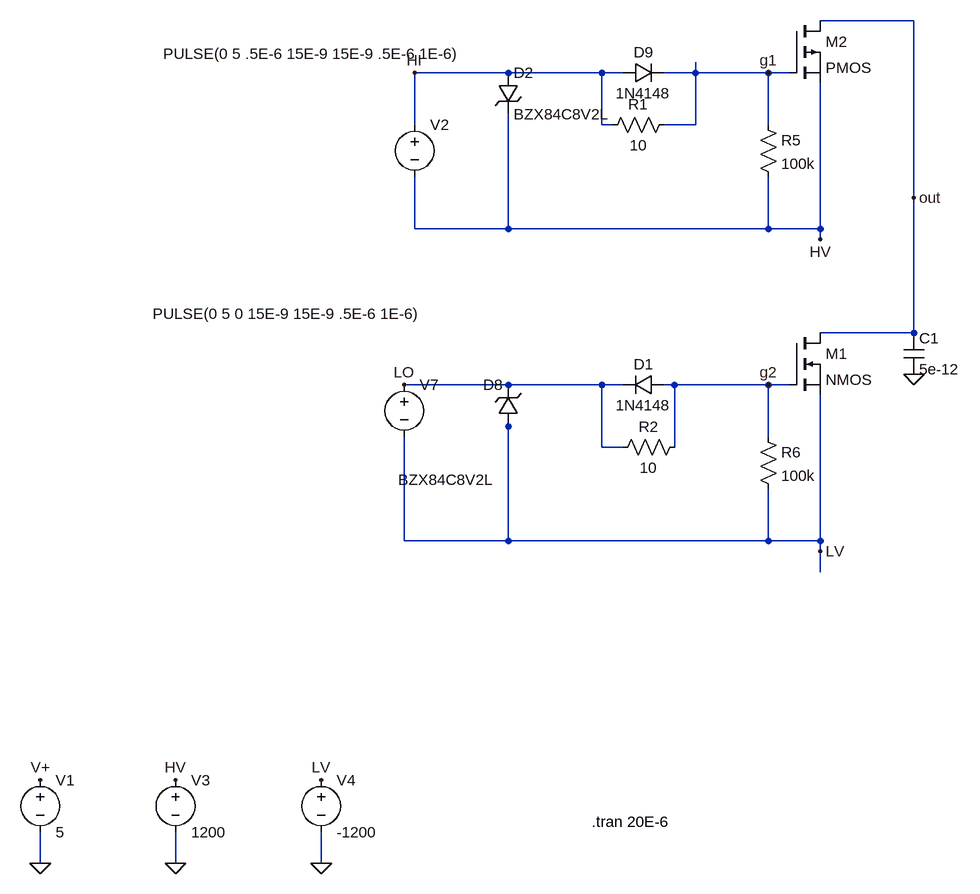
[diagram p0: schematic halfbridge.asc]
halfbridge.asc, the LTspice schematic file:
Version 4
SHEET 1 1824 692
WIRE 720 -1120 576 -1120
WIRE 96 -1040 -48 -1040
WIRE 240 -1040 96 -1040
WIRE 272 -1040 240 -1040
WIRE 384 -1040 384 -1056
WIRE 384 -1040 336 -1040
WIRE 496 -1040 384 -1040
WIRE 528 -1040 496 -1040
WIRE -48 -960 -48 -1040
WIRE 240 -960 240 -1040
WIRE 256 -960 240 -960
WIRE 384 -960 384 -1040
WIRE 384 -960 336 -960
WIRE 496 -960 496 -1040
WIRE 720 -848 720 -1120
WIRE -48 -800 -48 -880
WIRE 96 -800 96 -976
WIRE 96 -800 -48 -800
WIRE 496 -800 496 -880
WIRE 496 -800 96 -800
WIRE 576 -800 576 -1024
WIRE 576 -800 496 -800
WIRE 576 -784 576 -800
WIRE 720 -640 720 -848
WIRE 720 -640 576 -640
WIRE 96 -560 -64 -560
WIRE 240 -560 96 -560
WIRE 272 -560 240 -560
WIRE 352 -560 336 -560
WIRE 496 -560 352 -560
WIRE 528 -560 496 -560
WIRE 96 -496 96 -512
WIRE 496 -480 496 -560
WIRE 240 -464 240 -560
WIRE 272 -464 240 -464
WIRE 352 -464 352 -560
WIRE -64 -320 -64 -480
WIRE 96 -320 96 -496
WIRE 96 -320 -64 -320
WIRE 496 -320 496 -400
WIRE 496 -320 96 -320
WIRE 576 -320 576 -544
WIRE 576 -320 496 -320
WIRE 576 -304 576 -320
WIRE 576 -272 576 -304
WIRE -624 176 -624 128
WIRE -416 176 -416 128
WIRE -192 176 -192 128
FLAG -416 176 0
FLAG -416 48 HV
FLAG -192 176 0
FLAG -192 48 LV
FLAG 576 -784 HV
FLAG 576 -304 LV
FLAG -624 176 0
FLAG -624 48 V+
FLAG -48 -1040 HI
FLAG -64 -560 LO
FLAG 496 -1040 g1
FLAG 496 -560 g2
FLAG 720 -848 out
FLAG 720 -576 0
SYMBOL voltage -416 32 R0
WINDOW 123 0 0 Left 2
WINDOW 39 0 0 Left 2
SYMATTR InstName V3
SYMATTR Value 1200
SYMBOL voltage -192 32 R0
WINDOW 123 0 0 Left 2
WINDOW 39 0 0 Left 2
SYMATTR InstName V4
SYMATTR Value -1200
SYMBOL diode 272 -1024 R270
WINDOW 0 32 32 VTop 2
WINDOW 3 0 32 VBottom 2
SYMATTR InstName D9
SYMATTR Value 1N4148
SYMBOL zener 112 -496 R180
WINDOW 0 24 64 Left 2
WINDOW 3 38 -82 Left 2
SYMATTR InstName D8
SYMATTR Value BZX84C8V2L
SYMATTR Description Diode
SYMATTR Type diode
SYMBOL voltage -624 32 R0
WINDOW 123 0 0 Left 2
WINDOW 39 0 0 Left 2
SYMATTR InstName V1
SYMATTR Value 5
SYMBOL voltage -48 -976 R0
WINDOW 3 -387 -93 Left 2
WINDOW 123 0 0 Left 2
WINDOW 39 0 0 Left 2
SYMATTR Value PULSE(0 5 .5E-6 15E-9 15E-9 .5E-6 1E-6)
SYMATTR InstName V2
SYMBOL voltage -64 -576 R0
WINDOW 3 -387 -93 Left 2
WINDOW 123 0 0 Left 2
WINDOW 39 0 0 Left 2
SYMATTR Value PULSE(0 5 0 15E-9 15E-9 .5E-6 1E-6)
SYMATTR InstName V7
SYMBOL res 480 -976 R0
SYMATTR InstName R5
SYMATTR Value 100k
SYMBOL res 480 -496 R0
SYMATTR InstName R6
SYMATTR Value 100k
SYMBOL res 352 -976 R90
WINDOW 0 0 56 VBottom 2
WINDOW 3 32 56 VTop 2
SYMATTR InstName R1
SYMATTR Value 10
SYMBOL res 368 -480 R90
WINDOW 0 0 56 VBottom 2
WINDOW 3 32 56 VTop 2
SYMATTR InstName R2
SYMATTR Value 10
SYMBOL diode 336 -576 R90
WINDOW 0 0 32 VBottom 2
WINDOW 3 32 32 VTop 2
SYMATTR InstName D1
SYMATTR Value 1N4148
SYMBOL zener 80 -1040 R0
SYMATTR InstName D2
SYMATTR Value BZX84C8V2L
SYMATTR Description Diode
SYMATTR Type diode
SYMBOL nmos 528 -640 R0
SYMATTR InstName M1
SYMBOL cap 704 -640 R0
SYMATTR InstName C1
SYMATTR Value 5e-12
SYMBOL pmos 528 -1120 R0
SYMATTR InstName M2
TEXT 224 112 Left 2 !.tran 20E-6

The netlist it stands for:
* halfbridge.asc
V3 HV 0 1200
V4 LV 0 -1200
D9 HI g1 1N4148
D8 LV LO BZX84C8V2L
V1 V+ 0 5
V2 HI HV PULSE(0 5 .5E-6 15E-9 15E-9 .5E-6 1E-6)
V7 LO LV PULSE(0 5 0 15E-9 15E-9 .5E-6 1E-6)
R5 g1 HV 100k
R6 g2 LV 100k
R1 g1 HI 10
R2 g2 LO 10
D1 g2 LO 1N4148
D2 HI HV BZX84C8V2L
M1 out g2 LV LV NMOS
C1 out 0 5e-12
M2 out g1 HV HV PMOS
.model D D
.lib standard.dio
.model NMOS NMOS
.model PMOS PMOS
.lib standard.mos
.tran 20E-6
.backanno
.end